# Altium schematic sheet Main.SchDoc
size A4; SheetNumber: 3; SheetTotal: 10
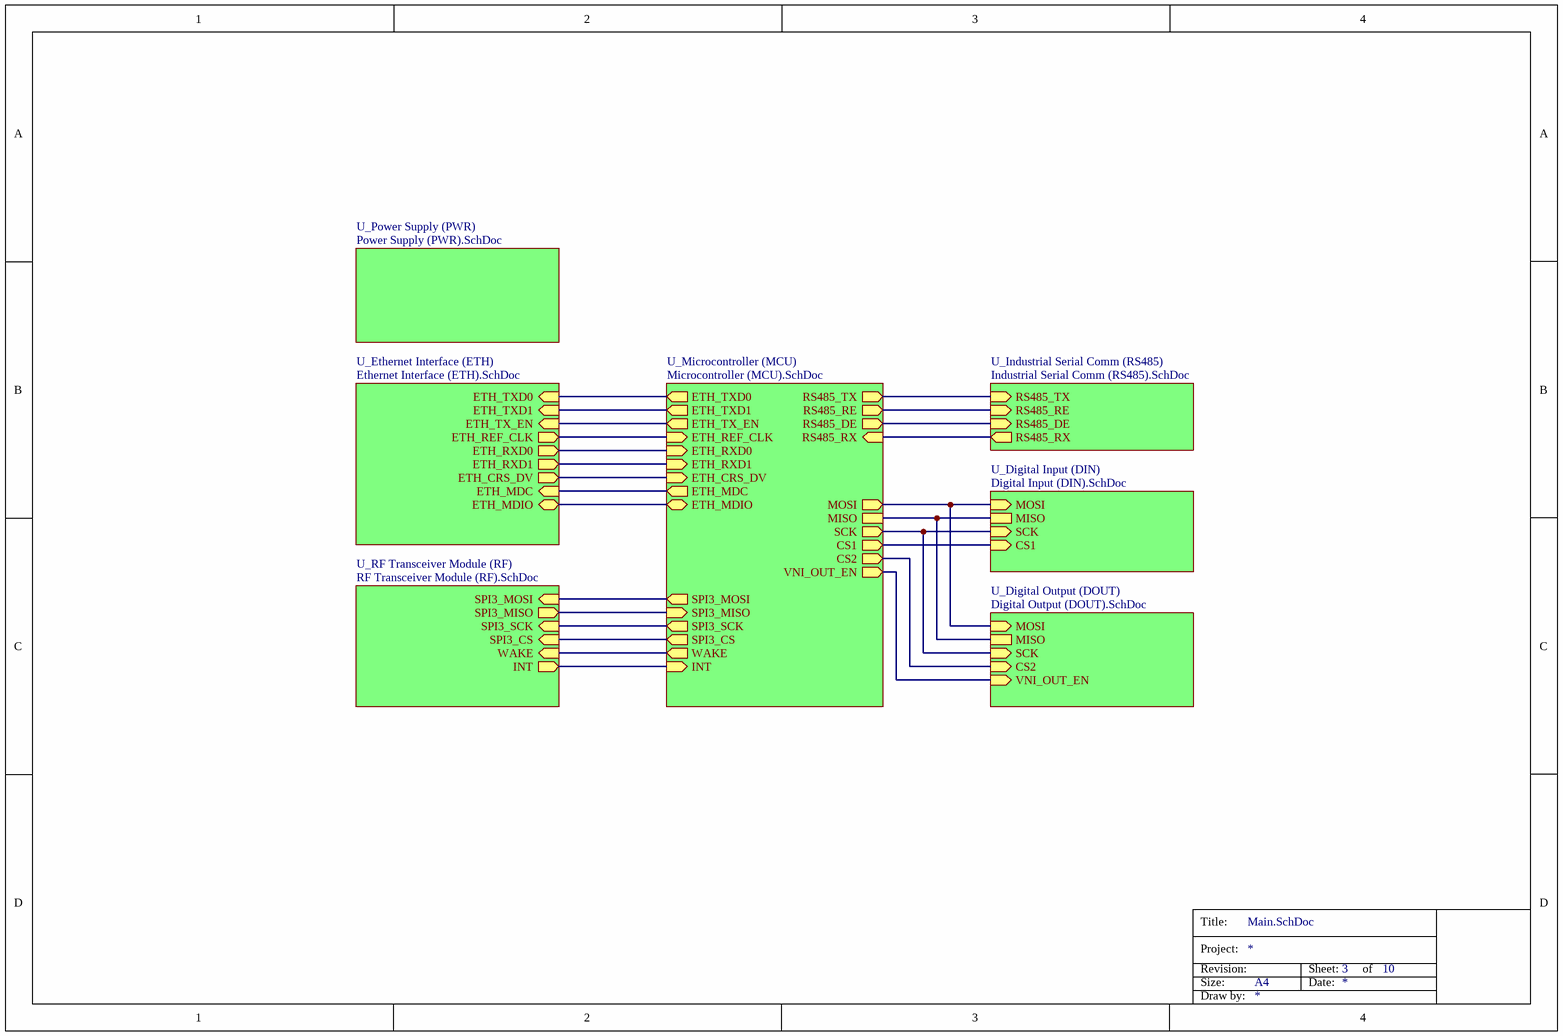
[diagram p0: Main.SchDoc]

## Sub-sheets
U_Digital Input (DIN) = Digital Input (DIN).SchDoc: MOSI (in), SCK (in), CS1 (in), MISO
U_Digital Output (DOUT) = Digital Output (DOUT).SchDoc: VNI_OUT_EN (in), MOSI (in), SCK (in), CS2 (in), MISO
U_Ethernet Interface (ETH) = Ethernet Interface (ETH).SchDoc: ETH_REF_CLK (out), ETH_RXD1 (out), ETH_RXD0 (out), ETH_MDIO (bidir), ETH_MDC (in), ETH_TXD1 (in), ETH_TXD0 (in), ETH_TX_EN (in), ETH_CRS_DV (out)
U_Industrial Serial Comm (RS485) = Industrial Serial Comm (RS485).SchDoc: RS485_TX (in), RS485_RX (out), RS485_RE (in), RS485_DE (in)
U_Microcontroller (MCU) = Microcontroller (MCU).SchDoc: ETH_REF_CLK (in), ETH_RXD1 (in), ETH_RXD0 (in), ETH_MDIO (bidir), ETH_MDC (out), ETH_TXD1 (out), ETH_TXD0 (out), ETH_TX_EN (out), ETH_CRS_DV (in), RS485_RX (in), RS485_TX (out), SPI3_CS (out), SPI3_SCK (out), SPI3_MISO (in), SPI3_MOSI (out), MOSI (out), SCK (out), CS1 (out), MISO, CS2 (out), VNI_OUT_EN (out), INT (in), RS485_RE (out), RS485_DE (out), WAKE (out)
U_Power Supply (PWR) = Power Supply (PWR).SchDoc: no entries
U_RF Transceiver Module (RF) = RF Transceiver Module (RF).SchDoc: SPI3_CS (in), SPI3_SCK (in), SPI3_MISO (out), SPI3_MOSI (in), INT (out), WAKE (in)

## Nets
(unnamed): sheet U_Microcontroller (MCU)/ETH_REF_CLK, sheet U_Ethernet Interface (ETH)/ETH_REF_CLK
(unnamed): sheet U_Microcontroller (MCU)/ETH_RXD1, sheet U_Ethernet Interface (ETH)/ETH_RXD1
(unnamed): sheet U_Microcontroller (MCU)/ETH_RXD0, sheet U_Ethernet Interface (ETH)/ETH_RXD0
(unnamed): sheet U_Microcontroller (MCU)/ETH_MDIO, sheet U_Ethernet Interface (ETH)/ETH_MDIO
(unnamed): sheet U_Microcontroller (MCU)/ETH_MDC, sheet U_Ethernet Interface (ETH)/ETH_MDC
(unnamed): sheet U_Microcontroller (MCU)/ETH_TXD1, sheet U_Ethernet Interface (ETH)/ETH_TXD1
(unnamed): sheet U_Microcontroller (MCU)/ETH_TXD0, sheet U_Ethernet Interface (ETH)/ETH_TXD0
(unnamed): sheet U_Microcontroller (MCU)/ETH_TX_EN, sheet U_Ethernet Interface (ETH)/ETH_TX_EN
(unnamed): sheet U_Microcontroller (MCU)/ETH_CRS_DV, sheet U_Ethernet Interface (ETH)/ETH_CRS_DV
(unnamed): sheet U_Microcontroller (MCU)/RS485_RX, sheet U_Industrial Serial Comm (RS485)/RS485_RX
(unnamed): sheet U_Microcontroller (MCU)/RS485_TX, sheet U_Industrial Serial Comm (RS485)/RS485_TX
(unnamed): sheet U_Microcontroller (MCU)/SPI3_CS, sheet U_RF Transceiver Module (RF)/SPI3_CS
(unnamed): sheet U_Microcontroller (MCU)/SPI3_SCK, sheet U_RF Transceiver Module (RF)/SPI3_SCK
(unnamed): sheet U_Microcontroller (MCU)/SPI3_MISO, sheet U_RF Transceiver Module (RF)/SPI3_MISO
(unnamed): sheet U_Microcontroller (MCU)/SPI3_MOSI, sheet U_RF Transceiver Module (RF)/SPI3_MOSI
(unnamed): sheet U_Microcontroller (MCU)/MOSI, sheet U_Digital Input (DIN)/MOSI, sheet U_Digital Output (DOUT)/MOSI
(unnamed): sheet U_Microcontroller (MCU)/SCK, sheet U_Digital Input (DIN)/SCK, sheet U_Digital Output (DOUT)/SCK
(unnamed): sheet U_Microcontroller (MCU)/CS1, sheet U_Digital Input (DIN)/CS1
(unnamed): sheet U_Microcontroller (MCU)/MISO, sheet U_Digital Input (DIN)/MISO, sheet U_Digital Output (DOUT)/MISO
(unnamed): sheet U_Microcontroller (MCU)/CS2, sheet U_Digital Output (DOUT)/CS2
(unnamed): sheet U_Microcontroller (MCU)/VNI_OUT_EN, sheet U_Digital Output (DOUT)/VNI_OUT_EN
(unnamed): sheet U_Microcontroller (MCU)/INT, sheet U_RF Transceiver Module (RF)/INT
(unnamed): sheet U_Microcontroller (MCU)/RS485_RE, sheet U_Industrial Serial Comm (RS485)/RS485_RE
(unnamed): sheet U_Microcontroller (MCU)/RS485_DE, sheet U_Industrial Serial Comm (RS485)/RS485_DE
(unnamed): sheet U_Microcontroller (MCU)/WAKE, sheet U_RF Transceiver Module (RF)/WAKE

## Notes on the sheet
- Title:
- Project:
- Revision:
- Size:
- A4
- Sheet:
- Date:
- of
- Draw by: